# Altium schematic sheet PowerAmp.SchDoc
size C; SheetNumber: 1; SheetTotal: 1; SPICEModelCacheCBGFHKVD: <root> / <DocumentId>CBGFHKVD</DocumentId> / </root>
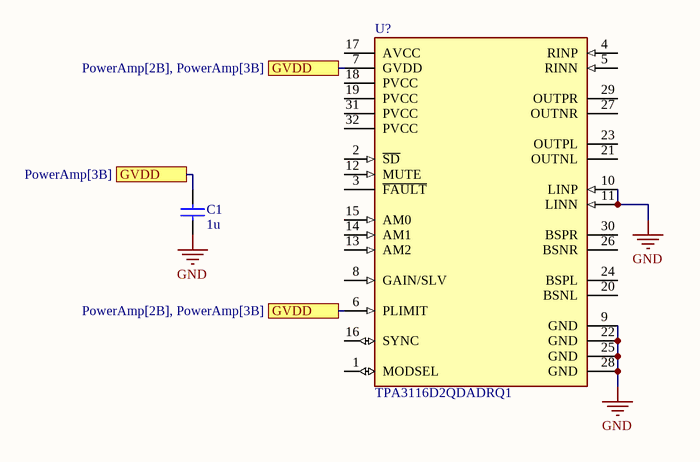
[diagram p0: PowerAmp.SchDoc]

## Parts
C1  value 1u  (hidden comment: Capacitor)
U?  TPA3116D2QDADRQ1  [FP-DAD0032C-MFG]

## Ports
GVDD (see PowerAmp[2B], PowerAmp[3B]), GVDD (see PowerAmp[3B])

## Nets
GND: C1.1 U?.9(GND) U?.10(LINP) U?.11(LINN) U?.22(GND) U?.25(GND) U?.28(GND)
GVDD: C1.2 U?.6(PLIMIT) U?.7(GVDD) ; port GVDD

Not connected (* = marked no-connect by the designer): U? 1(MODSEL) 2(~{SD}) 3(~{FAULT}) 4(RINP) 5(RINN) 8(GAIN/SLV) 12(MUTE) 13(AM2) 14(AM1) 15(AM0) 16(SYNC) 17(AVCC) 18(PVCC) 19(PVCC) 20(BSNL) 21(OUTNL) 23(OUTPL) 24(BSPL) 26(BSNR) 27(OUTNR) 29(OUTPR) 30(BSPR) 31(PVCC) 32(PVCC)

## Library data of the parts
C1 = Capacitor: SimulationGenericComponent: True
U? = CMP-04894-000022-1: IC AMP CLASS D STER 50W 32HTSSOP; Min Supply Voltage: 4.5V; Max Supply Voltage: 26V; Voltage Gain: 36dB; Lead Free: Lead Free; Number of Pins: 32; Max Output Power: 50W; Mount: Surface Mount; Max Operating Temperature: 125°C; RoHS Compliant: Yes; Min Operating Temperature: -40°C; Case/Package: TSSOP; Packaging: Tape and Reel